# Altium schematic sheet mc_wr.SchDoc
size A4
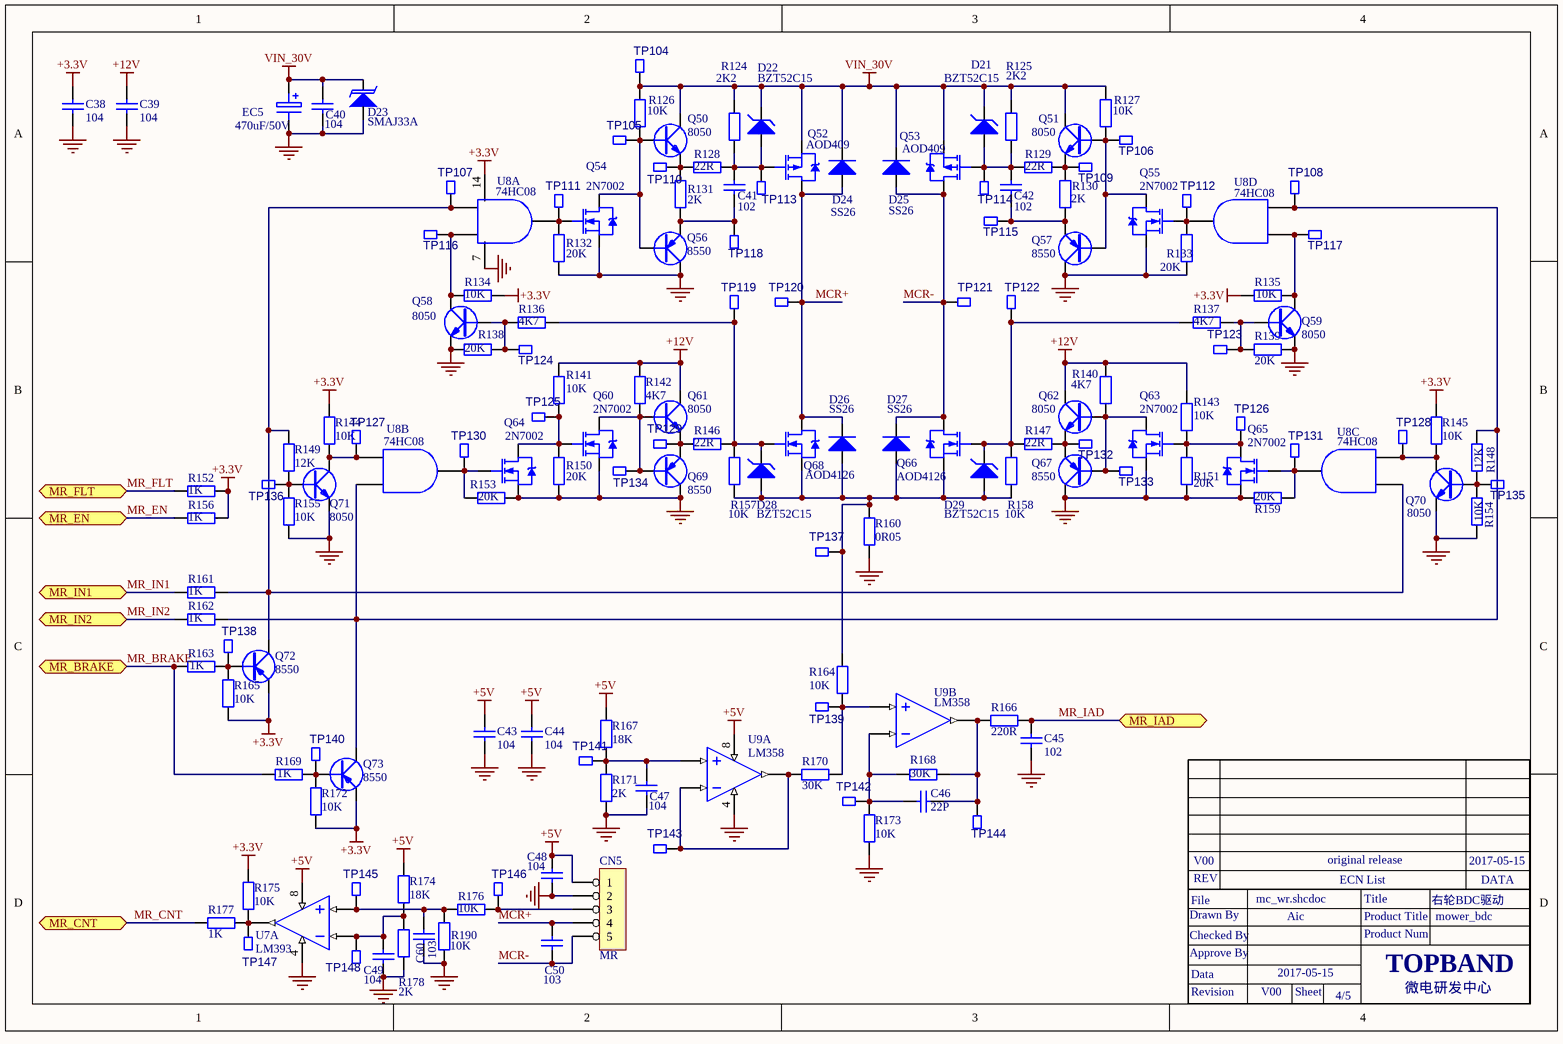
[diagram p0: mc_wr.SchDoc]

## Parts
C38  104  [0603C]
C39  104  [0603C]
C40  104  [0805C]
C41  102  [0805C]
C42  102  [0805C]
C43  104  [0603C]
C44  104  [0603C]
C45  102  [0603C]
C46  22P  [0603C]
C47  104  [0603C]
C48  104  [0603C]
C49  104  [0603C]
C50  103  [1206C]
C60  103  [0603C]
CN5  MR  [CON5-2.54]
D21  BZT52C15  [SOD-123]
D22  BZT52C15  [SOD-123]
D23  SMAJ33A  [DO-214AC]
D24  SS26  [SMB]
D25  SS26  [SMB]
D26  SS26  [SMB]
D27  SS26  [SMB]
D28  BZT52C15  [SOD-123]
D29  BZT52C15  [SOD-123]
EC5  470uF/50V  [EC12.5]
Q50  8050  [SOT-23-BCE]
Q51  8050  [SOT-23-BCE]
Q52  AOD409  [D-PACK-GDS]
Q53  AOD409  [D-PACK-GDS]
Q54  2N7002  [SOT-23-GDS]
Q55  2N7002  [SOT-23-GDS]
Q56  8550  [SOT-23-BCE]
Q57  8550  [SOT-23-BCE]
Q58  8050  [SOT-23-BCE]
Q59  8050  [SOT-23-BCE]
Q60  2N7002  [SOT-23-GDS]
Q61  8050  [SOT-23-BCE]
Q62  8050  [SOT-23-BCE]
Q63  2N7002  [SOT-23-GDS]
Q64  2N7002  [SOT-23-GDS]
Q65  2N7002  [SOT-23-GDS]
Q66  AOD4126  [D-PACK-GDS]
Q67  8550  [SOT-23-BCE]
Q68  AOD4126  [D-PACK-GDS]
Q69  8550  [SOT-23-BCE]
Q70  8050  [SOT-23-BCE]
Q71  8050  [SOT-23-BCE]
Q72  8550  [SOT-23-BCE]
Q73  8550  [SOT-23-BCE]
R124  2K2  [0805R]
R125  2K2  [0805R]
R126  10K  [0603R]
R127  10K  [0603R]
R128  22R  [0805R]
R129  22R  [0805R]
R130  2K  [0805R]
R131  2K  [0805R]
R132  20K  [0603R]
R133  20K  [0603R]
R134  10K  [0603R]
R135  10K  [0603R]
R136  4K7  [0603R]
R137  4K7  [0603R]
R138  20K  [0603R]
R139  20K  [0603R]
R140  4K7  [0603R]
R141  10K  [0603R]
R142  4K7  [0603R]
R143  10K  [0603R]
R144  10K  [0603R]
R145  10K  [0603R]
R146  22R  [0805R]
R147  22R  [0805R]
R148  12K  [0603R]
R149  12K  [0603R]
R150  20K  [0603R]
R151  20K  [0603R]
R152  1K  [0603R]
R153  20K  [0603R]
R154  10K  [0603R]
R155  10K  [0603R]
R156  1K  [0603R]
R157  10K  [0603R]
R158  10K  [0603R]
R159  20K  [0603R]
R160  0R05  [2512R]
R161  1K  [0603R]
R162  1K  [0603R]
R163  1K  [0603R]
R164  10K  [0603R]
R165  10K  [0603R]
R166  220R  [0603R]
R167  18K  [0603R]
R168  30K  [0603R]
R169  1K  [0603R]
R170  30K  [0603R]
R171  2K  [0603R]
R172  10K  [0603R]
R173  10K  [0603R]
R174  18K  [0603R]
R175  10K  [0603R]
R176  10K  [0603R]
R177  1K  [0603R]
R178  2K  [0603R]
R190  10K  [0603R]
TP104  TP  [TEST-0.8MM]  (value not drawn)
TP105  TP  [TEST-0.8MM]  (value not drawn)
TP106  TP  [TEST-0.8MM]  (value not drawn)
TP107  TP  [TEST-0.8MM]  (value not drawn)
TP108  TP  [TEST-0.8MM]  (value not drawn)
TP109  TP  [TEST-0.8MM]  (value not drawn)
TP110  TP  [TEST-0.8MM]  (value not drawn)
TP111  TP  [TEST-0.8MM]  (value not drawn)
TP112  TP  [TEST-0.8MM]  (value not drawn)
TP113  TP  [TEST-0.8MM]  (value not drawn)
TP114  TP  [TEST-0.8MM]  (value not drawn)
TP115  TP  [TEST-0.8MM]  (value not drawn)
TP116  TP  [TEST-0.8MM]  (value not drawn)
TP117  TP  [TEST-0.8MM]  (value not drawn)
TP118  TP  [TEST-0.8MM]  (value not drawn)
TP119  TP  [TEST-0.8MM]  (value not drawn)
TP120  TP  [TEST-0.8MM]  (value not drawn)
TP121  TP  [TEST-0.8MM]  (value not drawn)
TP122  TP  [TEST-0.8MM]  (value not drawn)
TP123  TP  [TEST-0.8MM]  (value not drawn)
TP124  TP  [TEST-0.8MM]  (value not drawn)
TP125  TP  [TEST-0.8MM]  (value not drawn)
TP126  TP  [TEST-0.8MM]  (value not drawn)
TP127  TP  [TEST-0.8MM]  (value not drawn)
TP128  TP  [TEST-0.8MM]  (value not drawn)
TP129  TP  [TEST-0.8MM]  (value not drawn)
TP130  TP  [TEST-0.8MM]  (value not drawn)
TP131  TP  [TEST-0.8MM]  (value not drawn)
TP132  TP  [TEST-0.8MM]  (value not drawn)
TP133  TP  [TEST-0.8MM]  (value not drawn)
TP134  TP  [TEST-0.8MM]  (value not drawn)
TP135  TP  [TEST-0.8MM]  (value not drawn)
TP136  TP  [TEST-0.8MM]  (value not drawn)
TP137  TP  [TEST-0.8MM]  (value not drawn)
TP138  TP  [TEST-0.8MM]  (value not drawn)
TP139  TP  [TEST-0.8MM]  (value not drawn)
TP140  TP  [TEST-0.8MM]  (value not drawn)
TP141  TP  [TEST-0.8MM]  (value not drawn)
TP142  TP  [TEST-0.8MM]  (value not drawn)
TP143  TP  [TEST-0.8MM]  (value not drawn)
TP144  TP  [TEST-0.8MM]  (value not drawn)
TP145  TP  [TEST-0.8MM]  (value not drawn)
TP146  TP  [TEST-0.8MM]  (value not drawn)
TP147  TP  [TEST-0.8MM]  (value not drawn)
TP148  TP  [TEST-0.8MM]  (value not drawn)
U7  LM393  [SO-8]  (part A of 2)
U8  74HC08  [SO-14]  (parts A,B,C,D of 4)
U9  LM358  [SO-8]  (parts A,B of 2)

## Ports
MR_BRAKE, MR_CNT, MR_EN, MR_FLT, MR_IAD, MR_IN1, MR_IN2

## Nets
+3.3V: C38.2 Q72.E Q73.E R134.2 R135.1 R144.1 R145.2 R152.2 R156.2 R165.2 R172.2 R175.2 U8.14(VCC)
+5V: C43.2 C44.2 C48.2 CN5.1 R167.2 R174.2 U7.8(VCC) U9.8(VCC)
+12V: C39.2 Q61.C Q62.C R140.1 R141.2 R142.2 R143.2
GND: C38.1 C39.1 C40.1 C43.1 C44.1 C45.2 C47.1 C48.1 C49.1 C60.1 CN5.2 D23.A EC5.2 Q54.S Q55.S Q56.C Q57.C Q58.E Q59.E Q60.S Q63.S Q64.S Q65.S Q67.C Q69.C Q70.E Q71.E R132.2 R133.1 R138.1 R139.2 R150.2 R151.2 R153.2 R154.1 R155.1 R159.1 R160.1 R171.1 R173.1 R178.1 R190.2 U7.4(GND) U8.7(GND) U9.4(GND)
VIN_30V: C40.2 D21.K D22.K D23.K D24.K D25.K EC5.1 Q50.C Q51.C Q52.S Q53.S R124.1 R125.1 R126.1 R127.1 TP104.1
MCR+: C50.2 CN5.4 D24.A D26.K Q52.D Q68.D TP120.1
MCR-: C50.1 CN5.5 D25.A D27.K Q53.D Q66.D TP121.1
MR_BRAKE: R163.2 R169.2 ; port MR_BRAKE
MR_CNT: R177.1 ; port MR_CNT
MR_EN: R156.1 ; port MR_EN
MR_FLT: R152.1 ; port MR_FLT
MR_IAD: C45.1 R166.2 ; port MR_IAD
MR_IN1: R161.1 ; port MR_IN1
MR_IN2: R162.1 ; port MR_IN2
NetC41_1: C41.1 D22.A Q52.G R124.2 R128.2 TP113.1
NetC41_2: C41.2 Q56.E R131.2 TP118.1
NetC42_1: C42.1 D21.A Q53.G R125.2 R129.1 TP114.1
NetC42_2: C42.2 Q57.E R130.2 TP115.1
NetC46_1: C46.1 R166.1 R168.1 TP144.1 U9.1(OUT2)
NetC46_2: C46.2 R168.2 R173.2 TP142.1 U9.2(-IN2)
NetC47_2: C47.2 R167.1 R171.2 TP141.1 U9.5(+IN1)
NetC49_2: C49.2 R174.1 R178.2 TP148.1 U7.6(-IN1)
NetC60_2: C60.2 R176.2 R190.1 TP145.1 U7.5(+IN1)
NetCN5_3: CN5.3 R176.1 TP146.1
NetD26_A: D26.A D27.A D28.A D29.A Q66.S Q68.S R157.1 R158.1 R160.2 R164.1 TP137.1
NetD28_K: D28.K Q68.G R136.2 R146.2 R157.2 TP119.1
NetD29_K: D29.K Q66.G R137.1 R147.1 R158.2 TP122.1
NetQ50_B: Q50.B Q54.D Q56.B R126.2 TP105.1
NetQ50_E: Q50.E R128.1 R131.1 TP110.1
NetQ51_B: Q51.B Q55.D Q57.B R127.2 TP106.1
NetQ51_E: Q51.E R129.2 R130.1 TP109.1
NetQ54_G: Q54.G R132.1 TP111.1 U8.3(1Y)
NetQ55_G: Q55.G R133.2 TP112.1 U8.11(4Y)
NetQ58_B: Q58.B R136.1 R138.2 TP124.1
NetQ58_C: Q58.C R134.1 TP116.1 U8.2(1B)
NetQ59_B: Q59.B R137.2 R139.1 TP123.1
NetQ59_C: Q59.C R135.2 TP117.1 U8.12(4A)
NetQ60_D: Q60.D Q61.B Q69.B R142.1 TP134.1
NetQ60_G: Q60.G Q64.D R141.1 R150.1 TP125.1
NetQ61_E: Q61.E Q69.E R146.1 TP129.1
NetQ62_B: Q62.B Q63.D Q67.B R140.2 TP133.1
NetQ62_E: Q62.E Q67.E R147.2 TP132.1
NetQ63_G: Q63.G Q65.D R143.1 R151.1 TP126.1
NetQ64_G: Q64.G R153.1 TP130.1 U8.6(2Y)
NetQ65_G: Q65.G R159.2 TP131.1 U8.8(3Y)
NetQ70_B: Q70.B R148.1 R154.2 TP135.1
NetQ70_C: Q70.C R145.1 TP128.1 U8.10(3B)
NetQ71_B: Q71.B R149.2 R155.2 TP136.1
NetQ71_C: Q71.C R144.2 TP127.1 U8.4(2A)
NetQ72_B: Q72.B R163.1 R165.1 TP138.1
NetQ72_C: Q72.C R149.1 R161.2 TP107.1 U8.1(1A) U8.9(3A)
NetQ73_B: Q73.B R169.1 R172.1 TP140.1
NetQ73_C: Q73.C R148.2 R162.2 TP108.1 U8.5(2B) U8.13(4B)
NetR164_2: R164.2 R170.2 TP139.1 U9.3(IN2+)
NetR170_1: R170.1 TP143.1 U9.6(-IN1) U9.7(OUT1)
NetR175_1: R175.1 R177.2 TP147.1 U7.7(OUT1)

## Notes on the sheet
- Drawn By
- File
- REV
- V00
- mc_wr.shcdoc
- Aic
- original release
- ECN List
- Product Title
- Title
- 右轮BDC驱动
- mower_bdc
- 2017-05-15
- DATA
- Approve By
- Checked By
- Data
- Product Num
- TOPBAND
- Revision
- Sheet
- 4/5
- 微电研发中心

## Library data of the parts
C38-C50 C60 = Cap(0603): Component Kind: standard; Component Type: standard
CN5 = 5Pin(2.54~7.92mm): 插座; U_TABLE: U_SAM01021601; id: 31; Part Number: 5Pin(2.54~7.92mm); Component Kind: Standard; Component Type: Standard; Designator: 5Pin(2.54~7.92mm); Pin Count: 5
D21 D22 D28 D29 = D Zener(贴片): 120301303; U_TABLE: U_SAM010203; id: 25; Description: 稳压二极管; Part Number: D Zener(贴片); Component Kind: standard; Component Type: standard; Pin Count: 2
D23 = Diode(TVS_贴片)_1: 120301346; U_TABLE: U_SAM010203; id: 28; Description: TVS管; Part Number: Diode(TVS_贴片)_1; Component Kind: standard; Component Type: standard; Pin Count: 2
D24-D27 = Diode(DO-35)-D: 二极管; U_TABLE: U_SAM010203; id: 32; Part Number: Diode(DO-35)-D; Component Kind: standard; Component Type: standard; Pin Count: 2
EC5 = Electro(2.5mm): 150200079; U_TABLE: U_SAM010202; id: 42; Description: 电解电容; Part Number: Electro(2.5mm); Component Kind: standard; Component Type: standard; Pin Count: 2
Q50 Q51 Q58 Q59 Q61 Q62 Q70 Q71 = NPN(贴片): 三极管; U_TABLE: U_SAM010204; id: 18; Part Number: NPN(贴片); Component Kind: standard; Component Type: standard; Pin Count: 3
Q52 Q53 = PMOS-2: MOS管; U_TABLE: U_SAM010204; id: 19; Part Number: PMOS-2; Component Kind: standard; Component Type: standard; Pin Count: 3
Q54 Q55 Q60 Q63-Q66 Q68 = NMOS-2: MOS管; U_TABLE: U_SAM010204; id: 17; Part Number: NMOS-2; Component Kind: standard; Component Type: standard; Pin Count: 3
Q56 Q57 Q67 Q69 Q72 Q73 = PNP(贴片): 三极管; U_TABLE: U_SAM010204; id: 20; Part Number: PNP(贴片); Component Kind: standard; Component Type: standard; Pin Count: 3
R124-R151 R153-R155 R157-R160 R175 = Res2: Resistor; Value: 1K; 物料编码: 150103083; Published: 8-Jun-2000; LatestRevisionDate: 17-Jul-2002; LatestRevisionNote: Re-released for DXP Platform.; PackageReference: AXIAL-0.4; Publisher: Altium Limited
R152 R156 R161-R163 R169 = Res2: Resistor; 物料编码: 150103083; Published: 8-Jun-2000; LatestRevisionDate: 17-Jul-2002; LatestRevisionNote: Re-released for DXP Platform.; PackageReference: AXIAL-0.4; Publisher: Altium Limited; Value: 1K
R164 R166 R168 R170 R173 = Res2: Resistor; Value: 1K; Published: 8-Jun-2000; LatestRevisionDate: 17-Jul-2002; LatestRevisionNote: Re-released for DXP Platform.; PackageReference: AXIAL-0.4; Publisher: Altium Limited
R165 R167 R171 R172 R174 R176-R178 R190 = Res2: Resistor; Published: 8-Jun-2000; LatestRevisionDate: 17-Jul-2002; LatestRevisionNote: Re-released for DXP Platform.; PackageReference: AXIAL-0.4; Publisher: Altium Limited
U7 = IC_LM358: 121000225; U_TABLE: U_SAM010210; Description: 集成电路; id: 83; U_ITEM_ID（物料编码）: 121000100; U_100076（型号）: LM358; U_100114（SAP物料描述）: SMT运放LM358_SO-8_TI_环保; U_100047（环保属性）: 环保; U_100107（工厂BOM使用频率）: 1000:1;1500:12;3000:7;5000:14;; U_100105（工厂库存）: 1000:7508.000;1500:160.000;2000:0.000;3000:485.000;5000:1542.000;; U_100117（工厂采购量）: 1000:7500.000;1500:300.000;3000:2500.000;5000:7500.000;; Part Number: IC_LM358; Component Kind: standard; Component Type: standard; Designator: IC_LM358; Footprint: DIP14; Pin Count: 8; U_100040（封装方式）: SO-8; U_100086（指定供应商）: TI
U9 = IC_LM358: 121000225; U_TABLE: U_SAM010210; Description: 集成电路; id: 83; U_ITEM_ID（物料编码）: 121000100; U_100114（SAP物料描述）: SMT运放LM358_SO-8_TI_环保; U_100047（环保属性）: 环保; U_100107（工厂BOM使用频率）: 1000:1;1500:12;3000:7;5000:14;; U_100105（工厂库存）: 1000:7508.000;1500:160.000;2000:0.000;3000:485.000;5000:1542.000;; U_100117（工厂采购量）: 1000:7500.000;1500:300.000;3000:2500.000;5000:7500.000;; Part Number: IC_LM358; Component Kind: standard; Component Type: standard; Designator: IC_LM358; Footprint: DIP14; Pin Count: 8; U_100076（型号）: LM358; U_100040（封装方式）: SO-8; U_100086（指定供应商）: TI